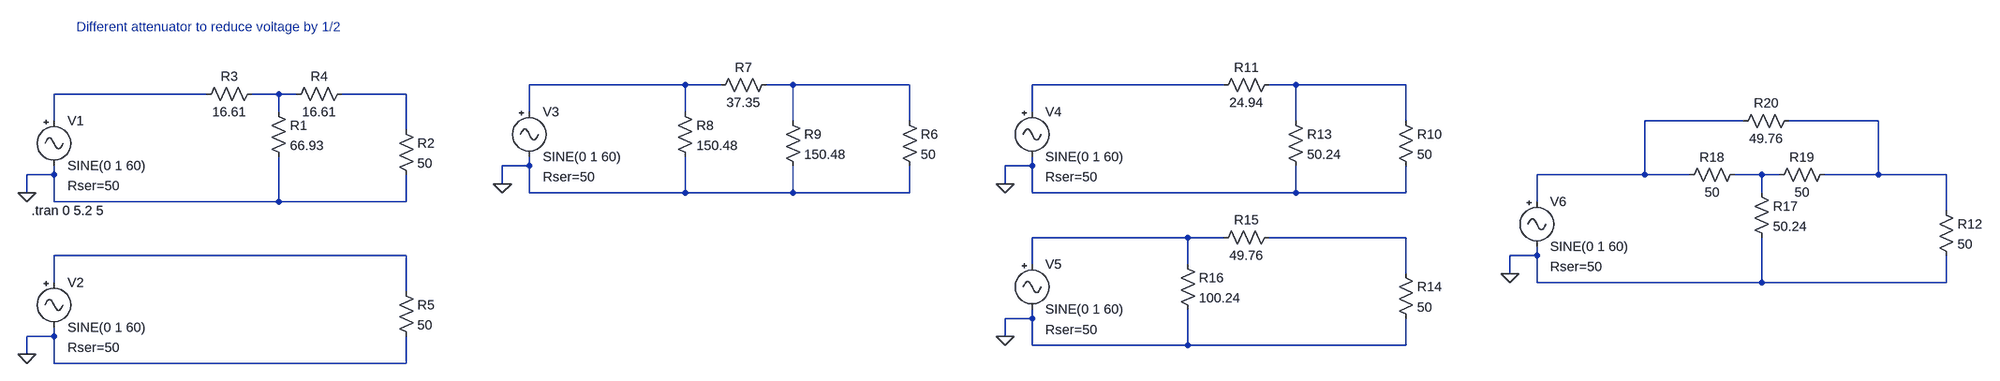
[diagram p0: schematic Attenueators.asc]
Attenueators.asc, the LTspice schematic file:
Version 4.1
SHEET 1 4052 680
WIRE 1488 80 1184 80
WIRE 1552 80 1488 80
WIRE 1680 80 1632 80
WIRE 1936 80 1680 80
WIRE 2560 80 2192 80
WIRE 2688 80 2640 80
WIRE 2944 80 2688 80
WIRE 400 96 128 96
WIRE 528 96 480 96
WIRE 560 96 528 96
WIRE 880 96 640 96
WIRE 528 128 528 96
WIRE 1184 128 1184 80
WIRE 1488 128 1488 80
WIRE 2192 128 2192 80
WIRE 128 144 128 96
WIRE 1680 144 1680 80
WIRE 1936 144 1936 80
WIRE 2688 144 2688 80
WIRE 2944 144 2944 80
WIRE 3600 144 3424 144
WIRE 3840 144 3680 144
WIRE 880 160 880 96
WIRE 1184 224 1184 208
WIRE 1184 224 1136 224
WIRE 2192 224 2192 208
WIRE 2192 224 2144 224
WIRE 128 240 128 224
WIRE 128 240 80 240
WIRE 3424 240 3424 144
WIRE 3424 240 3232 240
WIRE 3504 240 3424 240
WIRE 3632 240 3584 240
WIRE 3664 240 3632 240
WIRE 3840 240 3840 144
WIRE 3840 240 3744 240
WIRE 3984 240 3840 240
WIRE 1136 256 1136 224
WIRE 2144 256 2144 224
WIRE 80 272 80 240
WIRE 1184 272 1184 224
WIRE 1488 272 1488 208
WIRE 1488 272 1184 272
WIRE 1680 272 1680 224
WIRE 1680 272 1488 272
WIRE 1936 272 1936 224
WIRE 1936 272 1680 272
WIRE 2192 272 2192 224
WIRE 2688 272 2688 224
WIRE 2688 272 2192 272
WIRE 2944 272 2944 224
WIRE 2944 272 2688 272
WIRE 3632 272 3632 240
WIRE 128 288 128 240
WIRE 528 288 528 208
WIRE 528 288 128 288
WIRE 880 288 880 240
WIRE 880 288 528 288
WIRE 3232 288 3232 240
WIRE 3984 304 3984 240
WIRE 2496 352 2192 352
WIRE 2560 352 2496 352
WIRE 2944 352 2640 352
WIRE 880 384 128 384
WIRE 3232 384 3232 368
WIRE 3232 384 3184 384
WIRE 2192 400 2192 352
WIRE 2496 400 2496 352
WIRE 2944 416 2944 352
WIRE 3184 416 3184 384
WIRE 128 432 128 384
WIRE 3232 432 3232 384
WIRE 3632 432 3632 352
WIRE 3632 432 3232 432
WIRE 3984 432 3984 384
WIRE 3984 432 3632 432
WIRE 880 448 880 384
WIRE 2192 496 2192 480
WIRE 2192 496 2144 496
WIRE 128 528 128 512
WIRE 128 528 80 528
WIRE 2144 528 2144 496
WIRE 2192 544 2192 496
WIRE 2496 544 2496 480
WIRE 2496 544 2192 544
WIRE 2944 544 2944 496
WIRE 2944 544 2496 544
WIRE 80 560 80 528
WIRE 128 576 128 528
WIRE 880 576 880 528
WIRE 880 576 128 576
FLAG 80 272 0
FLAG 80 560 0
FLAG 1136 256 0
FLAG 2144 256 0
FLAG 2144 528 0
FLAG 3184 416 0
SYMBOL Misc\\signal 128 128 R0
WINDOW 123 0 0 Left 0
WINDOW 39 24 132 Left 2
SYMATTR SpiceLine Rser=50
SYMATTR InstName V1
SYMATTR Value SINE(0 1 60)
SYMBOL res 864 144 R0
SYMATTR InstName R2
SYMATTR Value 50
SYMBOL res 512 112 R0
SYMATTR InstName R1
SYMATTR Value 66.93
SYMBOL res 384 112 R270
WINDOW 0 32 56 VTop 2
WINDOW 3 0 56 VBottom 2
SYMATTR InstName R3
SYMATTR Value 16.61
SYMBOL res 544 112 R270
WINDOW 0 32 56 VTop 2
WINDOW 3 0 56 VBottom 2
SYMATTR InstName R4
SYMATTR Value 16.61
SYMBOL Misc\\signal 128 416 R0
WINDOW 123 0 0 Left 0
WINDOW 39 24 132 Left 2
SYMATTR SpiceLine Rser=50
SYMATTR InstName V2
SYMATTR Value SINE(0 1 60)
SYMBOL res 864 432 R0
SYMATTR InstName R5
SYMATTR Value 50
SYMBOL Misc\\signal 1184 112 R0
WINDOW 123 0 0 Left 0
WINDOW 39 24 132 Left 2
SYMATTR SpiceLine Rser=50
SYMATTR InstName V3
SYMATTR Value SINE(0 1 60)
SYMBOL res 1920 128 R0
SYMATTR InstName R6
SYMATTR Value 50
SYMBOL res 1536 96 R270
WINDOW 0 32 56 VTop 2
WINDOW 3 0 56 VBottom 2
SYMATTR InstName R7
SYMATTR Value 37.35
SYMBOL res 1472 112 R0
SYMATTR InstName R8
SYMATTR Value 150.48
SYMBOL res 1664 128 R0
SYMATTR InstName R9
SYMATTR Value 150.48
SYMBOL Misc\\signal 2192 112 R0
WINDOW 123 0 0 Left 0
WINDOW 39 24 132 Left 2
SYMATTR SpiceLine Rser=50
SYMATTR InstName V4
SYMATTR Value SINE(0 1 60)
SYMBOL res 2928 128 R0
SYMATTR InstName R10
SYMATTR Value 50
SYMBOL res 2544 96 R270
WINDOW 0 32 56 VTop 2
WINDOW 3 0 56 VBottom 2
SYMATTR InstName R11
SYMATTR Value 24.94
SYMBOL res 2672 128 R0
SYMATTR InstName R13
SYMATTR Value 50.24
SYMBOL Misc\\signal 2192 384 R0
WINDOW 123 0 0 Left 0
WINDOW 39 24 132 Left 2
SYMATTR SpiceLine Rser=50
SYMATTR InstName V5
SYMATTR Value SINE(0 1 60)
SYMBOL res 2928 400 R0
SYMATTR InstName R14
SYMATTR Value 50
SYMBOL res 2544 368 R270
WINDOW 0 32 56 VTop 2
WINDOW 3 0 56 VBottom 2
SYMATTR InstName R15
SYMATTR Value 49.76
SYMBOL res 2480 384 R0
SYMATTR InstName R16
SYMATTR Value 100.24
SYMBOL Misc\\signal 3232 272 R0
WINDOW 123 0 0 Left 0
WINDOW 39 24 132 Left 2
SYMATTR SpiceLine Rser=50
SYMATTR InstName V6
SYMATTR Value SINE(0 1 60)
SYMBOL res 3968 288 R0
SYMATTR InstName R12
SYMATTR Value 50
SYMBOL res 3616 256 R0
SYMATTR InstName R17
SYMATTR Value 50.24
SYMBOL res 3488 256 R270
WINDOW 0 32 56 VTop 2
WINDOW 3 0 56 VBottom 2
SYMATTR InstName R18
SYMATTR Value 50
SYMBOL res 3648 256 R270
WINDOW 0 32 56 VTop 2
WINDOW 3 0 56 VBottom 2
SYMATTR InstName R19
SYMATTR Value 50
SYMBOL res 3584 160 R270
WINDOW 0 32 56 VTop 2
WINDOW 3 0 56 VBottom 2
SYMATTR InstName R20
SYMATTR Value 49.76
TEXT 88 304 Left 2 !.tran 0 5.2 5
TEXT 168 -24 Left 2 ;Different attenuator to reduce voltage by 1/2

The netlist it stands for:
* Attenueators.asc
V1 N005 0 SINE(0 1 60) Rser=50
R2 N007 0 50
R1 N006 0 66.93
R3 N005 N006 16.61
R4 N006 N007 16.61
V2 N013 0 SINE(0 1 60) Rser=50
R5 N013 0 50
V3 N001 0 SINE(0 1 60) Rser=50
R6 N002 0 50
R7 N001 N002 37.35
R8 N001 0 150.48
R9 N002 0 150.48
V4 N003 0 SINE(0 1 60) Rser=50
R10 N004 0 50
R11 N003 N004 24.94
R13 N004 0 50.24
V5 N011 0 SINE(0 1 60) Rser=50
R14 N012 0 50
R15 N011 N012 49.76
R16 N011 0 100.24
V6 N008 0 SINE(0 1 60) Rser=50
R12 N009 0 50
R17 N010 0 50.24
R18 N008 N010 50
R19 N010 N009 50
R20 N008 N009 49.76
.tran 0 5.2 5
* Different attenuator to reduce voltage by 1/2
.backanno
.end